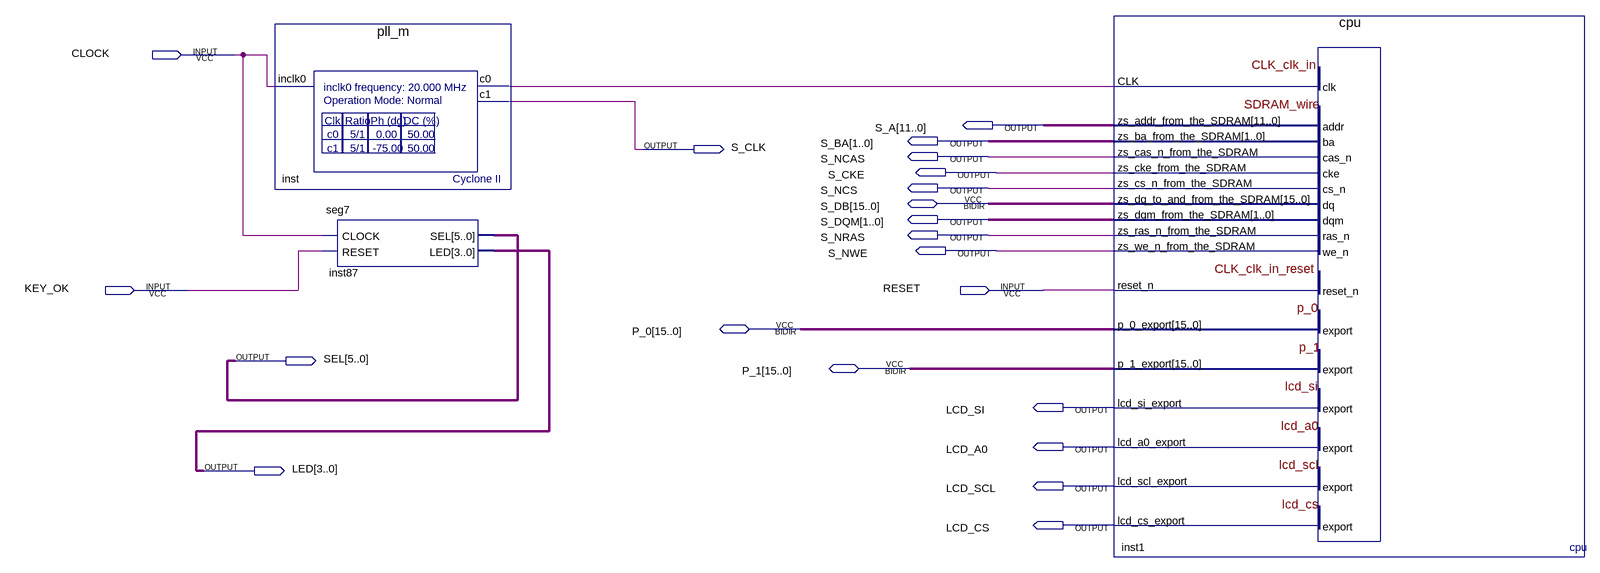
[diagram p0: schematic sheet]
// Quartus schematic Pre_Exp.bdf as structural Verilog: 3 symbols, 21 pins
module Pre_Exp (
  input  CLOCK,
  input  KEY_OK,
  input  RESET,
  inout  [15:0] S_DB,
  inout  [15:0] P_0,
  inout  [15:0] P_1,
  output [11:0] S_A,
  output [1:0] S_BA,
  output S_CLK,
  output S_NCAS,
  output S_CKE,
  output S_NCS,
  output [1:0] S_DQM,
  output S_NRAS,
  output S_NWE,
  output [5:0] SEL,
  output LCD_SI,
  output LCD_A0,
  output [3:0] LED,
  output LCD_SCL,
  output LCD_CS
);

  wire inst_c0;

  pll_m inst (.inclk0(CLOCK), .c0(inst_c0), .c1(S_CLK));
  seg7 inst87 (.CLOCK(CLOCK), .RESET(KEY_OK), .SEL(SEL), .LED(LED));
  cpu inst1 (
    .CLK(inst_c0), .reset_n(RESET), .zs_addr_from_the_SDRAM(S_A), .zs_ba_from_the_SDRAM(S_BA),
    .zs_cas_n_from_the_SDRAM(S_NCAS), .zs_cke_from_the_SDRAM(S_CKE), .zs_cs_n_from_the_SDRAM(S_NCS),
    .zs_dqm_from_the_SDRAM(S_DQM), .zs_ras_n_from_the_SDRAM(S_NRAS), .zs_we_n_from_the_SDRAM(S_NWE),
    .lcd_si_export(LCD_SI), .lcd_a0_export(LCD_A0), .lcd_scl_export(LCD_SCL), .lcd_cs_export(LCD_CS),
    .zs_dq_to_and_from_the_SDRAM(S_DB), .p_0_export(P_0), .p_1_export(P_1));
endmodule
